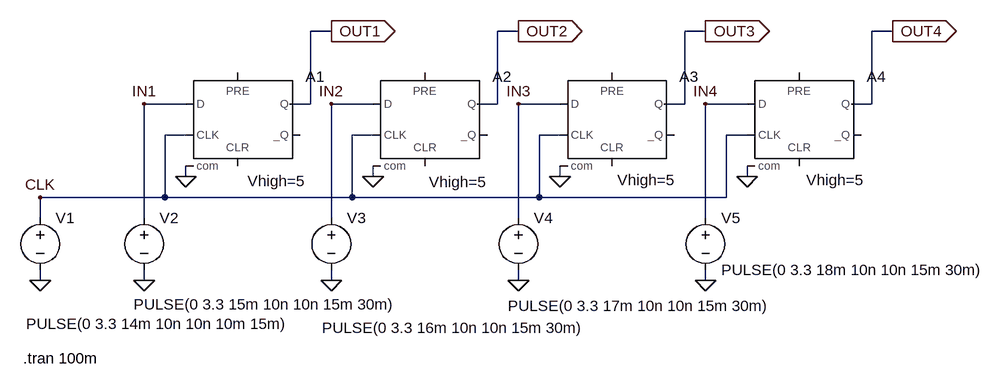
[diagram p0: schematic PIPO_ShiftRegister.asc]
PIPO_ShiftRegister.asc, the LTspice schematic file:
Version 4
SHEET 1 1352 680
WIRE 288 0 256 0
WIRE 576 0 544 0
WIRE 864 0 832 0
WIRE 1152 0 1120 0
WIRE 64 112 0 112
WIRE 256 112 256 0
WIRE 256 112 224 112
WIRE 352 112 288 112
WIRE 544 112 544 0
WIRE 544 112 512 112
WIRE 640 112 576 112
WIRE 832 112 832 0
WIRE 832 112 800 112
WIRE 928 112 864 112
WIRE 1120 112 1120 0
WIRE 1120 112 1088 112
WIRE 64 160 32 160
WIRE 352 160 320 160
WIRE 640 160 608 160
WIRE 928 160 896 160
WIRE 64 224 64 208
WIRE 352 224 352 208
WIRE 640 224 640 208
WIRE 928 224 928 208
WIRE 32 256 32 160
WIRE 32 256 -160 256
WIRE 320 256 320 160
WIRE 320 256 32 256
WIRE 608 256 608 160
WIRE 608 256 320 256
WIRE 896 256 896 160
WIRE 896 256 608 256
WIRE -160 288 -160 256
WIRE 0 288 0 112
WIRE 288 288 288 112
WIRE 576 288 576 112
WIRE 864 288 864 112
WIRE -160 384 -160 368
WIRE 0 384 0 368
WIRE 288 384 288 368
WIRE 576 384 576 368
WIRE 864 384 864 368
FLAG 288 0 OUT1
IOPIN 288 0 Out
FLAG 576 0 OUT2
IOPIN 576 0 Out
FLAG 864 0 OUT3
IOPIN 864 0 Out
FLAG 1152 0 OUT4
IOPIN 1152 0 Out
FLAG -160 384 0
FLAG 0 384 0
FLAG 288 384 0
FLAG 576 384 0
FLAG 864 384 0
FLAG -160 256 CLK
FLAG 0 112 IN1
FLAG 288 112 IN2
FLAG 576 112 IN3
FLAG 864 112 IN4
FLAG 64 224 0
FLAG 352 224 0
FLAG 640 224 0
FLAG 928 224 0
SYMBOL Digital\\dflop 144 64 R0
WINDOW 3 15 167 Left 2
SYMATTR InstName A1
SYMATTR Value Vhigh=5
SYMBOL Digital\\dflop 432 64 R0
WINDOW 3 6 168 Left 2
SYMATTR InstName A2
SYMATTR Value Vhigh=5
SYMBOL Digital\\dflop 720 64 R0
WINDOW 3 8 165 Left 2
SYMATTR InstName A3
SYMATTR Value Vhigh=5
SYMBOL Digital\\dflop 1008 64 R0
WINDOW 3 11 165 Left 2
SYMATTR InstName A4
SYMATTR Value Vhigh=5
SYMBOL voltage -160 272 R0
WINDOW 3 -22 179 Left 2
WINDOW 123 0 0 Left 2
WINDOW 39 0 0 Left 2
SYMATTR InstName V1
SYMATTR Value PULSE(0 3.3 14m 10n 10n 10m 15m)
SYMBOL voltage 0 272 R0
WINDOW 3 -16 149 Left 2
WINDOW 123 0 0 Left 2
WINDOW 39 0 0 Left 2
SYMATTR InstName V2
SYMATTR Value PULSE(0 3.3 15m 10n 10n 15m 30m)
SYMBOL voltage 288 272 R0
WINDOW 3 -14 185 Left 2
WINDOW 123 0 0 Left 2
WINDOW 39 0 0 Left 2
SYMATTR InstName V3
SYMATTR Value PULSE(0 3.3 16m 10n 10n 15m 30m)
SYMBOL voltage 576 272 R0
WINDOW 3 -16 151 Left 2
WINDOW 123 0 0 Left 2
WINDOW 39 0 0 Left 2
SYMATTR InstName V4
SYMATTR Value PULSE(0 3.3 17m 10n 10n 15m 30m)
SYMBOL voltage 864 272 R0
WINDOW 123 0 0 Left 2
WINDOW 39 0 0 Left 2
SYMATTR InstName V5
SYMATTR Value PULSE(0 3.3 18m 10n 10n 15m 30m)
TEXT -186 504 Left 2 !.tran 100m

The netlist it stands for:
* PIPO_ShiftRegister.asc
A1 IN1 0 CLK 0 0 0 OUT1 0 DFLOP Vhigh=5
A2 IN2 0 CLK 0 0 0 OUT2 0 DFLOP Vhigh=5
A3 IN3 0 CLK 0 0 0 OUT3 0 DFLOP Vhigh=5
A4 IN4 0 CLK 0 0 0 OUT4 0 DFLOP Vhigh=5
V1 CLK 0 PULSE(0 3.3 14m 10n 10n 10m 15m)
V2 IN1 0 PULSE(0 3.3 15m 10n 10n 15m 30m)
V3 IN2 0 PULSE(0 3.3 16m 10n 10n 15m 30m)
V4 IN3 0 PULSE(0 3.3 17m 10n 10n 15m 30m)
V5 IN4 0 PULSE(0 3.3 18m 10n 10n 15m 30m)
.tran 100m
.backanno
.end